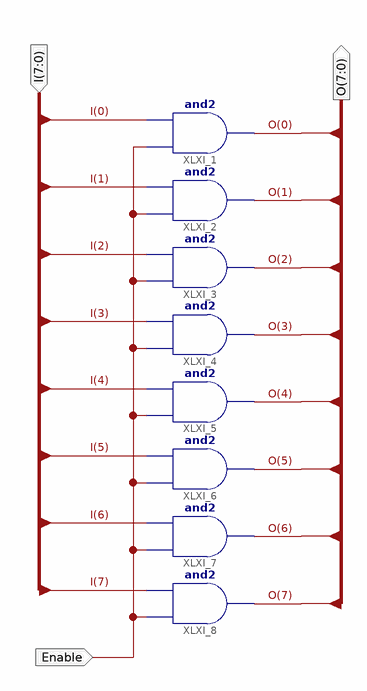
[diagram p0: schematic sheet 1]
// Xilinx ISE schematic buf8be.sch (spartan6) as structural Verilog: 8 symbols, 3 ports
module buf8be (
  input  Enable,
  input  [7:0] I,
  output [7:0] O
);

  and XLXI_1 (O[0], Enable, I[0]);
  and XLXI_2 (O[1], Enable, I[1]);
  and XLXI_3 (O[2], Enable, I[2]);
  and XLXI_4 (O[3], Enable, I[3]);
  and XLXI_8 (O[7], Enable, I[7]);
  and XLXI_7 (O[6], Enable, I[6]);
  and XLXI_6 (O[5], Enable, I[5]);
  and XLXI_5 (O[4], Enable, I[4]);
endmodule
